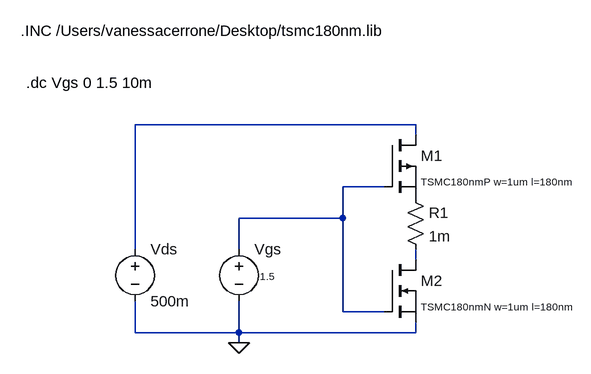
[diagram p0: schematic cmos.asc]
cmos.asc, the LTspice schematic file:
Version 4
SHEET 1 880 796
WIRE 352 240 -80 240
WIRE 352 256 352 240
WIRE 304 336 240 336
WIRE 240 384 240 336
WIRE 240 384 80 384
WIRE -80 432 -80 240
WIRE 80 432 80 384
WIRE 352 448 352 432
WIRE 240 528 240 384
WIRE 304 528 240 528
WIRE -80 560 -80 512
WIRE 80 560 80 512
WIRE 80 560 -80 560
WIRE 352 560 352 544
WIRE 352 560 80 560
WIRE 80 576 80 560
FLAG 80 576 0
SYMBOL voltage -80 416 R0
SYMATTR InstName Vds
SYMATTR Value 500m
SYMBOL voltage 80 416 R0
WINDOW 3 44 68 Bottom 1
SYMATTR Value 1.5
SYMATTR InstName Vgs
SYMBOL res 336 336 R0
SYMATTR InstName R1
SYMATTR Value 1m
SYMBOL pmos 304 256 R0
WINDOW 3 56 72 Left 1
SYMATTR Value TSMC180nmP w=1um l=180nm
SYMATTR InstName M1
SYMBOL nmos 304 448 R0
WINDOW 3 56 72 Left 1
SYMATTR Value TSMC180nmN w=1um l=180nm
SYMATTR InstName M2
TEXT -256 96 Left 2 !.INC /Users/vanessacerrone/Desktop/tsmc180nm.lib
TEXT -248 176 Left 2 !.dc Vgs 0 1.5 10m

The netlist it stands for:
* cmos.asc
Vds N001 0 500m
Vgs N002 0 1.5
R1 P001 N003 1m
M1 N001 N002 P001 P001 TSMC180nmP w=1um l=180nm
M2 N003 N002 0 0 TSMC180nmN w=1um l=180nm
.model NMOS NMOS
.model PMOS PMOS
.lib standard.mos
.INC /Users/vanessacerrone/Desktop/tsmc180nm.lib
.dc Vgs 0 1.5 10m
.backanno
.end